# Altium project Enigma Rev B.PrjPCB (part 8 of 8)

## Sheet Power Main Regulators.SchDoc: Main Regulator
size Tabloid; ApprovedBy: NA; CompanyName: Cospan Design LLC; DrawnBy: Dave McCoy; Engineer: Dave McCoy; DocumentNumber: 20; Revision: A; SheetNumber: 20; SheetTotal: 20; Client: Public; Project: Enigma; ProjectPrettyName: Enigma
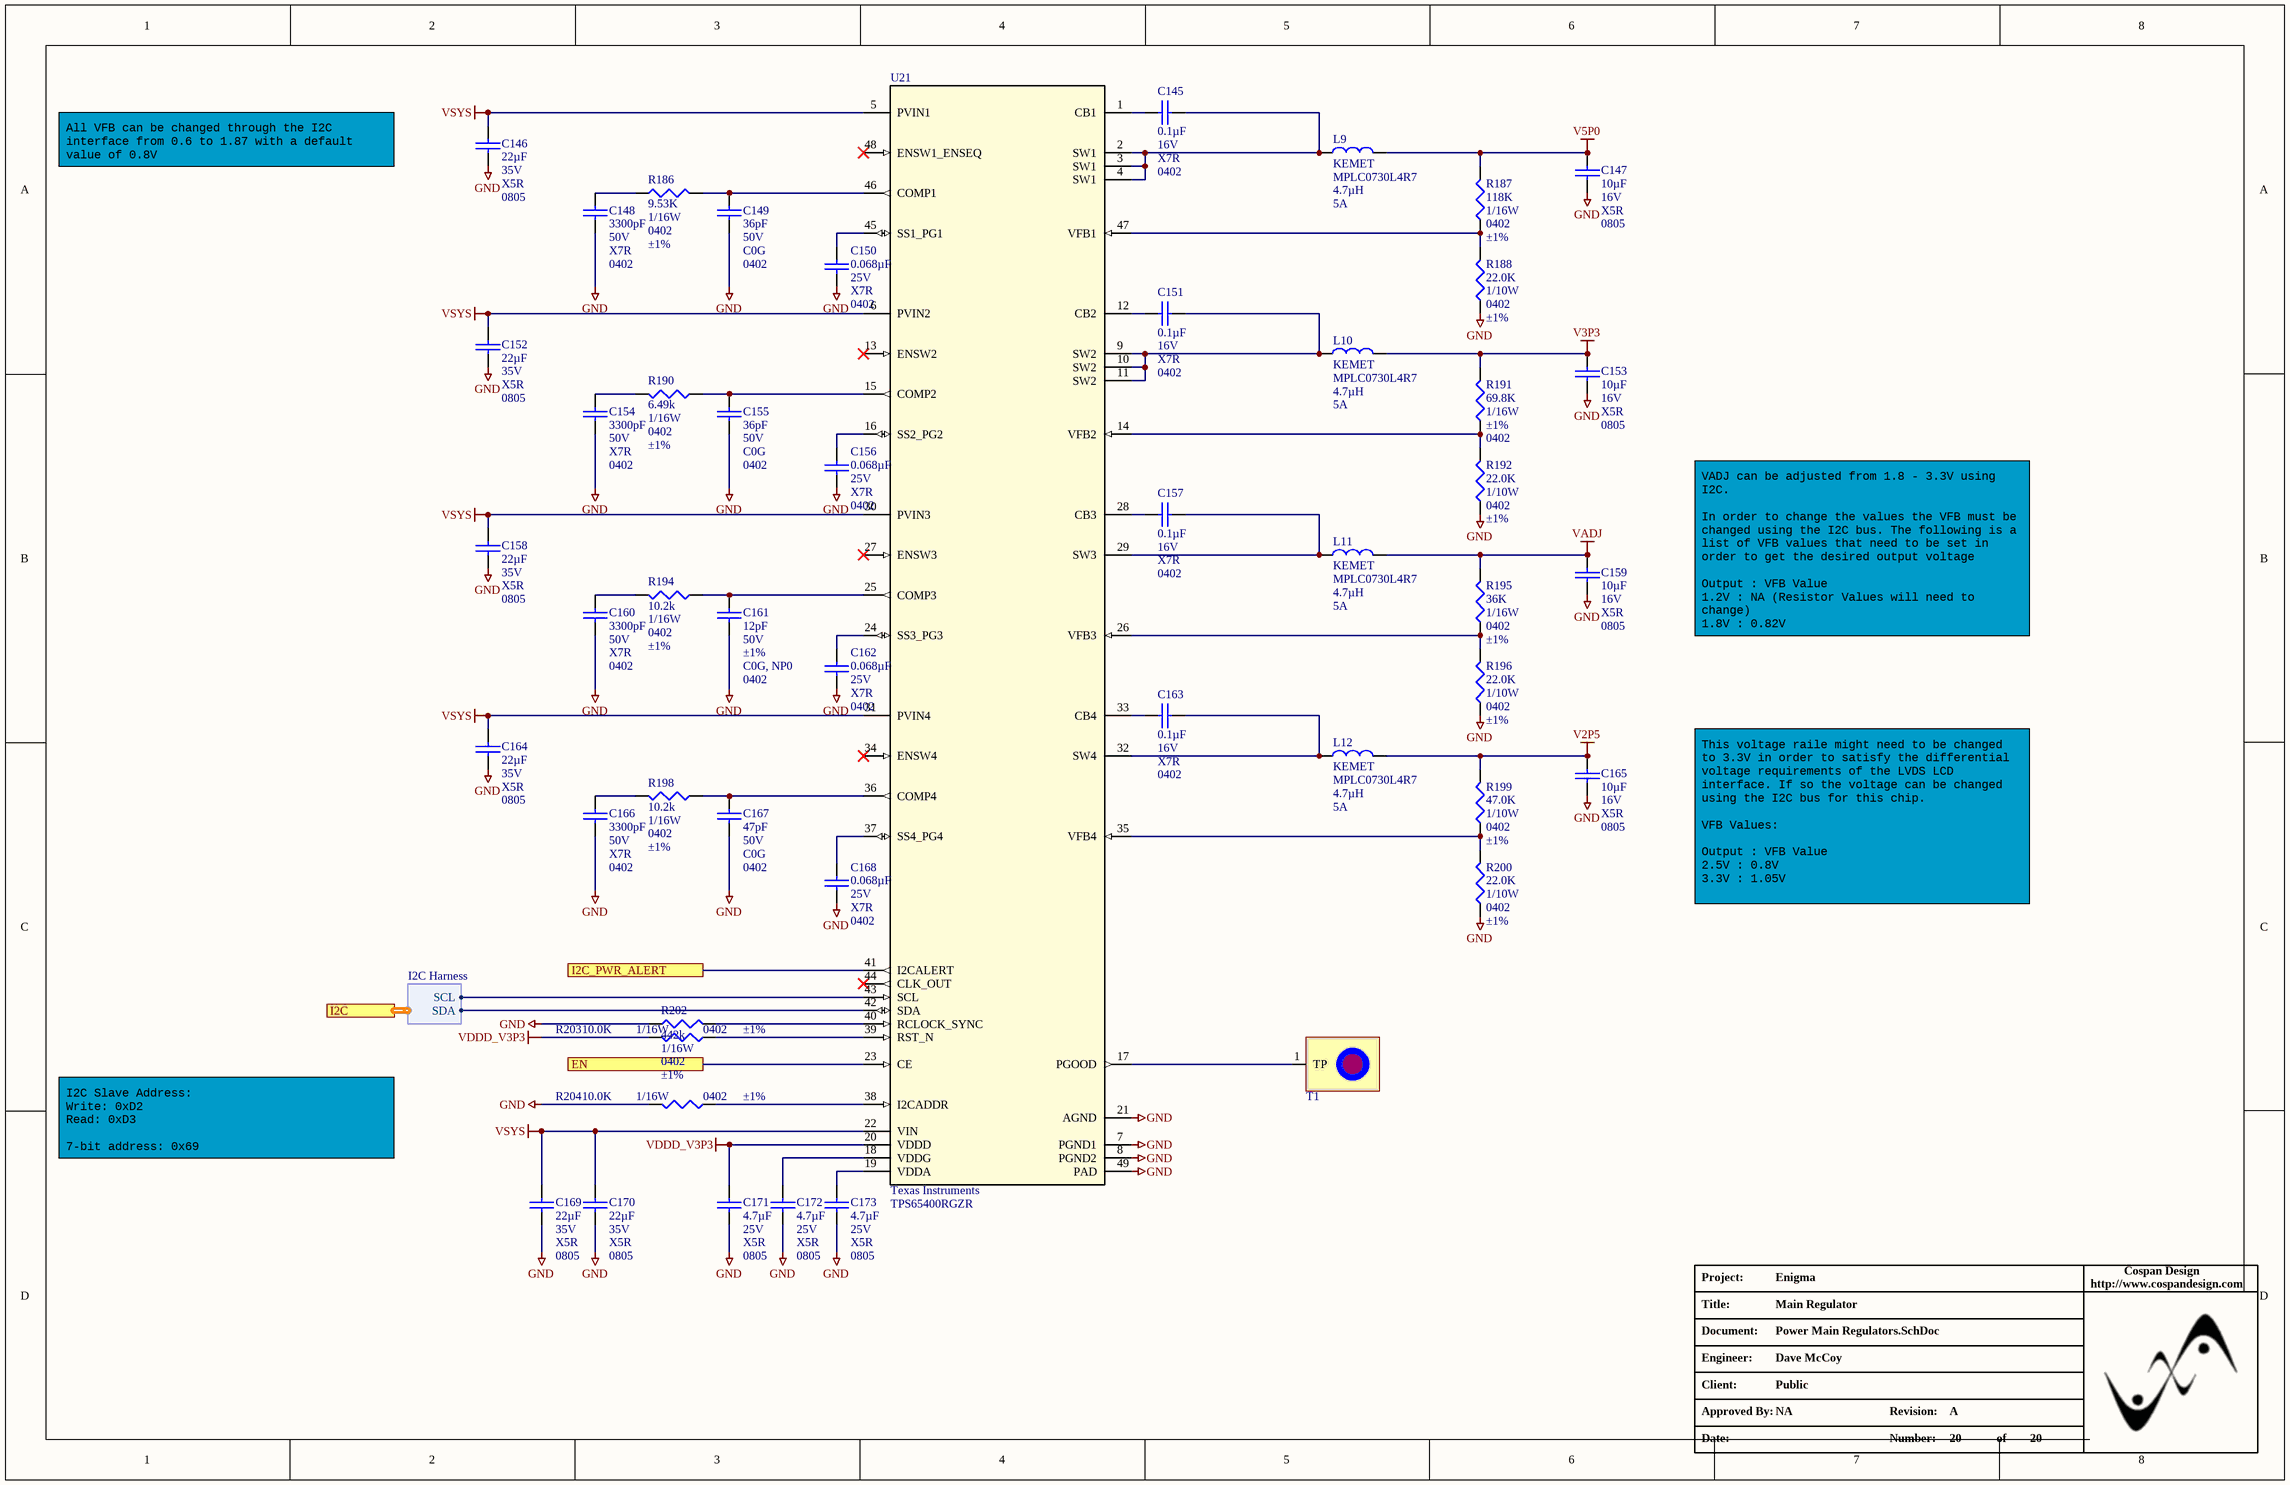
[diagram p13: Power Main Regulators.SchDoc]

### Parts
C145  Capacitance: 0.1µF  Voltage - Rated: 16V  Temperature Coefficient: X7R  Package / Case: 0402  [C_0402]  (hidden comment: 0.1uF)
C146  Capacitance: 22µF  Voltage - Rated: 35V  Temperature Coefficient: X5R  Package / Case: 0805  [C_ERA-0805]  (hidden comment: C_0805_22µF_35V)
C147  Voltage - Rated: 16V  Temperature Coefficient: X5R  Package / Case: 0805  [C_ERA-0805]  (hidden comment: 10µF)
C148  Capacitance: 3300pF  Voltage - Rated: 50V  Temperature Coefficient: X7R  Package / Case: 0402  [C_ERA-0402]  (hidden comment: C_0402_3.3nF_50V)
C149  Capacitance: 36pF  Voltage - Rated: 50V  Temperature Coefficient: C0G  Package / Case: 0402  [C_0402]  (hidden comment: C_0402_36pF)
C150  Capacitance: 0.068µF  Voltage - Rated: 25V  Temperature Coefficient: X7R  Package / Case: 0402  [C_0402]  (hidden comment: C_0402_68nF)
C151  Capacitance: 0.1µF  Voltage - Rated: 16V  Temperature Coefficient: X7R  Package / Case: 0402  [C_0402]  (hidden comment: 0.1uF)
C152  Capacitance: 22µF  Voltage - Rated: 35V  Temperature Coefficient: X5R  Package / Case: 0805  [C_ERA-0805]  (hidden comment: C_0805_22µF_35V)
C153  Voltage - Rated: 16V  Temperature Coefficient: X5R  Package / Case: 0805  [C_ERA-0805]  (hidden comment: 10µF)
C154  Capacitance: 3300pF  Voltage - Rated: 50V  Temperature Coefficient: X7R  Package / Case: 0402  [C_ERA-0402]  (hidden comment: C_0402_3.3nF_50V)
C155  Capacitance: 36pF  Voltage - Rated: 50V  Temperature Coefficient: C0G  Package / Case: 0402  [C_0402]  (hidden comment: C_0402_36pF)
C156  Capacitance: 0.068µF  Voltage - Rated: 25V  Temperature Coefficient: X7R  Package / Case: 0402  [C_0402]  (hidden comment: C_0402_68nF)
C157  Capacitance: 0.1µF  Voltage - Rated: 16V  Temperature Coefficient: X7R  Package / Case: 0402  [C_0402]  (hidden comment: 0.1uF)
C158  Capacitance: 22µF  Voltage - Rated: 35V  Temperature Coefficient: X5R  Package / Case: 0805  [C_ERA-0805]  (hidden comment: C_0805_22µF_35V)
C159  Voltage - Rated: 16V  Temperature Coefficient: X5R  Package / Case: 0805  [C_ERA-0805]  (hidden comment: 10µF)
C160  Capacitance: 3300pF  Voltage - Rated: 50V  Temperature Coefficient: X7R  Package / Case: 0402  [C_ERA-0402]  (hidden comment: C_0402_3.3nF_50V)
C161  Voltage - Rated: 50V  Tolerance: ±1%  Temperature Coefficient: C0G, NP0  Package / Case: 0402  [C_ERA-0402]  (hidden comment: 12pF)
C162  Capacitance: 0.068µF  Voltage - Rated: 25V  Temperature Coefficient: X7R  Package / Case: 0402  [C_0402]  (hidden comment: C_0402_68nF)
C163  Capacitance: 0.1µF  Voltage - Rated: 16V  Temperature Coefficient: X7R  Package / Case: 0402  [C_0402]  (hidden comment: 0.1uF)
C164  Capacitance: 22µF  Voltage - Rated: 35V  Temperature Coefficient: X5R  Package / Case: 0805  [C_ERA-0805]  (hidden comment: C_0805_22µF_35V)
C165  Voltage - Rated: 16V  Temperature Coefficient: X5R  Package / Case: 0805  [C_ERA-0805]  (hidden comment: 10µF)
C166  Capacitance: 3300pF  Voltage - Rated: 50V  Temperature Coefficient: X7R  Package / Case: 0402  [C_ERA-0402]  (hidden comment: C_0402_3.3nF_50V)
C167  Voltage - Rated: 50V  Temperature Coefficient: C0G  Package / Case: 0402  [C_0402]  (hidden comment: 47pF)
C168  Capacitance: 0.068µF  Voltage - Rated: 25V  Temperature Coefficient: X7R  Package / Case: 0402  [C_0402]  (hidden comment: C_0402_68nF)
C169  Capacitance: 22µF  Voltage - Rated: 35V  Temperature Coefficient: X5R  Package / Case: 0805  [C_ERA-0805]  (hidden comment: C_0805_22µF_35V)
C170  Capacitance: 22µF  Voltage - Rated: 35V  Temperature Coefficient: X5R  Package / Case: 0805  [C_ERA-0805]  (hidden comment: C_0805_22µF_35V)
C171  Voltage - Rated: 25V  Temperature Coefficient: X5R  Package / Case: 0805  [C_ERA-0805]  (hidden comment: 4.7µF)
C172  Voltage - Rated: 25V  Temperature Coefficient: X5R  Package / Case: 0805  [C_ERA-0805]  (hidden comment: 4.7µF)
C173  Voltage - Rated: 25V  Temperature Coefficient: X5R  Package / Case: 0805  [C_ERA-0805]  (hidden comment: 4.7µF)
L9  Manufacturer: KEMET  Manufacturer Part Number: MPLC0730L4R7  Inductance: 4.7µH  Max DC Current: 5A  [KEM_L9004_MPLC]  (hidden comment: L_MPLC0730L4R7)
L10  Manufacturer: KEMET  Manufacturer Part Number: MPLC0730L4R7  Inductance: 4.7µH  Max DC Current: 5A  [KEM_L9004_MPLC]  (hidden comment: L_MPLC0730L4R7)
L11  Manufacturer: KEMET  Manufacturer Part Number: MPLC0730L4R7  Inductance: 4.7µH  Max DC Current: 5A  [KEM_L9004_MPLC]  (hidden comment: L_MPLC0730L4R7)
L12  Manufacturer: KEMET  Manufacturer Part Number: MPLC0730L4R7  Inductance: 4.7µH  Max DC Current: 5A  [KEM_L9004_MPLC]  (hidden comment: L_MPLC0730L4R7)
R186  Resistance In Ohms: 9.53K  Power (Watts): 1/16W  Case: 0402  Tolerance: ±1%  [R_0402]  (hidden comment: R_0402_9.53K)
R187  Resistance In Ohms: 118K  Power (Watts): 1/16W  Case: 0402  Tolerance: ±1%  [R_0402]  (hidden comment: R_0402_118K)
R188  Resistance In Ohms: 22.0K  Power (Watts): 1/10W  Case: 0402  Tolerance: ±1%  [R_0402]  (hidden comment: R_0402_22.0K)
R190  Resistance In Ohms: 6.49k  Power (Watts): 1/16W  Case: 0402  Tolerance: ±1%  [R_0402]  (hidden comment: R_0402_6.49k)
R191  Resistance In Ohms: 69.8K  Power (Watts): 1/16W  Tolerance: ±1%  Case: 0402  [R_0402]  (hidden comment: R_0402_69.8K)
R192  Resistance In Ohms: 22.0K  Power (Watts): 1/10W  Case: 0402  Tolerance: ±1%  [R_0402]  (hidden comment: R_0402_22.0K)
R194  Resistance In Ohms: 10.2k  Power (Watts): 1/16W  Case: 0402  Tolerance: ±1%  [R_0402]  (hidden comment: R_0402_10.2k)
R195  Resistance In Ohms: 36K  Power (Watts): 1/16W  Case: 0402  Tolerance: ±1%  [R_0402]  (hidden comment: R_0402_36.0K)
R196  Resistance In Ohms: 22.0K  Power (Watts): 1/10W  Case: 0402  Tolerance: ±1%  [R_0402]  (hidden comment: R_0402_22.0K)
R198  Resistance In Ohms: 10.2k  Power (Watts): 1/16W  Case: 0402  Tolerance: ±1%  [R_0402]  (hidden comment: R_0402_10.2k)
R199  Resistance In Ohms: 47.0K  Power (Watts): 1/10W  Case: 0402  Tolerance: ±1%  [R_0402]  (hidden comment: R_0402_47.0K)
R200  Resistance In Ohms: 22.0K  Power (Watts): 1/10W  Case: 0402  Tolerance: ±1%  [R_0402]  (hidden comment: R_0402_22.0K)
R202  Resistance In Ohms: 442k  Power (Watts): 1/16W  Case: 0402  Tolerance: ±1%  [R_0402]  (hidden comment: R_0402_442k)
R203  Resistance In Ohms: 10.0K  Power (Watts): 1/16W  Case: 0402  Tolerance: ±1%  [R_0402]  (hidden comment: R_0402_10.0K)
R204  Resistance In Ohms: 10.0K  Power (Watts): 1/16W  Case: 0402  Tolerance: ±1%  [R_0402]  (hidden comment: R_0402_10.0K)
T1  TEST_POINT_SMALL  [TestPointSmall]  (value not drawn)  (no BOM)
U21  Manufacturer: Texas Instruments  Manufacturer Part Number: TPS65400RGZR  [RGZ0048B]  (hidden comment: U_TPS65400RGZR)

### Ports
EN, I2C (harness I2C Harness), I2C_PWR_ALERT

### Harnesses
I2C Harness: SCL, SDA

### Nets
GND: C146.1 C147.1 C148.1 C149.1 C150.1 C152.1 C153.1 C154.1 C155.1 C156.1 C158.1 C159.1 C160.1 C161.1 C162.1 C164.1 C165.1 C166.1 C167.1 C168.1 C169.1 C170.1 C171.1 C172.1 C173.1 R188.2 R192.2 R196.2 R200.2 R202.2 R204.1 U21.7(PGND1) U21.8(PGND2) U21.21(AGND) U21.49(PAD)
V2P5: C165.2 L12.1 R199.1
V3P3: C153.2 L10.1 R191.1
V5P0: C147.2 L9.1 R187.1
VADJ: C159.2 L11.1 R195.1
VDDD_V3P3: C171.2 R203.1 U21.20(VDDD)
VSYS: C146.2 C152.2 C158.2 C164.2 C169.2 C170.2 U21.5(PVIN1) U21.6(PVIN2) U21.22(VIN) U21.30(PVIN3) U21.31(PVIN4)
INT_REG_EN: U21.23(CE) ; port EN
TOUCH_SCL: U21.43(SCL) ; port I2C.SCL
TOUCH_SDA: U21.42(SDA) ; port I2C.SDA
NetC145_1: C145.1 L9.2 U21.2(SW1) U21.3(SW1) U21.4(SW1)
NetC145_2: C145.2 U21.1(CB1)
NetC148_2: C148.2 R186.2
NetC149_2: C149.2 R186.1 U21.46(COMP1)
NetC150_2: C150.2 U21.45(SS1_PG1)
NetC151_1: C151.1 L10.2 U21.9(SW2) U21.10(SW2) U21.11(SW2)
NetC151_2: C151.2 U21.12(CB2)
NetC154_2: C154.2 R190.1
NetC155_2: C155.2 R190.2 U21.15(COMP2)
NetC156_2: C156.2 U21.16(SS2_PG2)
NetC157_1: C157.1 L11.2 U21.29(SW3)
NetC157_2: C157.2 U21.28(CB3)
NetC160_2: C160.2 R194.1
NetC161_2: C161.2 R194.2 U21.25(COMP3)
NetC162_2: C162.2 U21.24(SS3_PG3)
NetC163_1: C163.1 L12.2 U21.32(SW4)
NetC163_2: C163.2 U21.33(CB4)
NetC166_2: C166.2 R198.1
NetC167_2: C167.2 R198.2 U21.36(COMP4)
NetC168_2: C168.2 U21.37(SS4_PG4)
NetC172_2: C172.2 U21.18(VDDG)
NetC173_2: C173.2 U21.19(VDDA)
NetR187_2: R187.2 R188.1 U21.47(VFB1)
NetR191_2: R191.2 R192.1 U21.14(VFB2)
NetR195_2: R195.2 R196.1 U21.26(VFB3)
NetR199_2: R199.2 R200.1 U21.35(VFB4)
NetR202_1: R202.1 U21.40(RCLOCK_SYNC)
NetR203_2: R203.2 U21.39(RST_N)
NetR204_2: R204.2 U21.38(I2CADDR)
NetT1_1: T1.1(TP) U21.17(PGOOD)
NetT2_1: U21.41(I2CALERT) ; port I2C_PWR_ALERT

Not connected (* = marked no-connect by the designer): U21 13(ENSW2)* 27(ENSW3)* 34(ENSW4)* 44(CLK_OUT)* 48(ENSW1_ENSEQ)*

### Notes on the sheet
- All VFB can be changed through the I2C interface from 0.6 to 1.87 with a default value of 0.8V
- VADJ can be adjusted from 1.8 - 3.3V using I2C.
  In order to change the values the VFB must be changed using the I2C bus. The following is a list of VFB values that need to be set in order to get the desired output voltage
  Output	: VFB Value
  1.2V	: NA (Resistor Values will need to change)
  1.8V	: 0.82V
  2.5V	: 1.14V
  3.3V	: 1.51V
- This voltage raile might need to be changed to 3.3V in order to satisfy the differential voltage requirements of the LVDS LCD interface. If so the voltage can be changed using the I2C bus for this chip.
  VFB Values:
  Output	: VFB Value
  2.5V	: 0.8V
  3.3V	: 1.05V
- I2C Slave Address:
  Write: 0xD2
  Read: 0xD3
  7-bit address: 0x69
- Project:
- http://www.cospandesign.com
- Cospan Design
- Document:
- Engineer:
- Title:
- Client:
- Approved By:
- Revision:
- Date:
- Number:
- of

### Library data of the parts
C145 C151 C157 C163 = C_0402_0.1UF_16V: CAP CER .10UF 16V X7R 0402; Manufacturer: Murata Electronics North America; Manufacturer Part Number: GRM155R71C104KA88J; Tolerance: ±10%; Supplier 1: Digi-Key; RoHS: RoHS Compliant; Category: Capacitors; Stock 1: 18103134; Pricing 1: 1=0.1, 10=0.014, 100=0.0062, 500=0.00442, 1000=0.00348, 2500=0.00316, 5000=0.00291 (USD); Packaging: Cut Tape (CT); Part Status: Active; Operating Temperature: -55°C ~ 125°C; Features: -; Ratings: -; Applications: General Purpose; Mounting Type: Surface Mount, MLCC; Size / Dimension: 0.039" L x 0.020" W (1.00mm x 0.50mm); Height - Seated (Max): -; Thickness (Max): 0.022" (0.55mm); Lead Spacing: -; ComponentLink1URL: http://www.murata.com/~/media/webrenewal/support/library/catalog/products/capacitor/mlcc/c02e.ashx?la=en-us; ComponentLink1Description: http://www.murata.com/~/media/webrenewal/support/library/catalog/products/capacitor/mlcc/c02e.ashx?la=en-us; Supplier Part Number 1: 490-6328-1-ND
C146 C152 C158 C164 C169 C170 = C_0805_22µF_35V: CAP CER 22UF 35V X5R 0805; Manufacturer: TDK Corporation; Manufacturer Part Number: C2012X5R1V226M125AC; Tolerance: ±20%; Supplier 1: Digi-Key; RoHS: RoHS Compliant; Category: Capacitors; Stock 1: 3681; Pricing 1: 1=1.14, 10=0.863, 100=0.6176, 500=0.47818, 1000=0.41176 (USD); Packaging: Cut Tape (CT); Mounting Type: Surface Mount, MLCC; Operating Temperature: -55°C ~ 85°C; Applications: General Purpose; Ratings: -; Size / Dimension: 0.079" L x 0.049" W (2.00mm x 1.25mm); Height - Seated (Max): -; Thickness (Max): 0.057" (1.45mm); Lead Spacing: -; Features: Low ESL; Lead Style: -; ComponentLink1URL: https://product.tdk.com/info/en/catalog/datasheets/mlcc_commercial_general_en.pdf; ComponentLink1Description: https://product.tdk.com/info/en/catalog/datasheets/mlcc_commercial_general_en.pdf; Supplier Part Number 1: 445-14428-1-ND; Part Status: Active; Failure Rate: -
C147 C153 C159 C165 = C_0805_10UF_16V: CAP CER 10uF 16V X5R 20% 0805; Manufacturer: Taiyo Yuden; Manufacturer Part Number: EMK212BJ106KG-T; Tolerance: ±10%; Supplier 1: Digi-Key; Supplier Part Number 1: 587-1295-1-ND; Category: Capacitors; Stock 1: 2052124; Capacitance: 10µF; RoHS: RoHS Compliant; Pricing 1: 1=0.2, 10=0.139, 100=0.0656, 500=0.04596, 1000=0.03805 (USD); Packaging: Cut Tape (CT); Part Status: Active; Operating Temperature: -55°C ~ 85°C; Features: -; Ratings: -; Applications: General Purpose; Mounting Type: Surface Mount, MLCC; Size / Dimension: 0.079" L x 0.049" W (2.00mm x 1.25mm); Height - Seated (Max): -; Thickness (Max): 0.053" (1.35mm); Lead Spacing: -; Lead Style: -; ComponentLink1URL: http://www.yuden.co.jp/productdata/catalog/en/mlcc01_e.pdf; ComponentLink1Description: http://www.yuden.co.jp/productdata/catalog/en/mlcc01_e.pdf
C148 C154 C160 C166 = C_0402_3.3nF_50V: Manufacturer: Murata Electronics North America; Manufacturer Part Number: GRM155R71H332KA01D; Tolerance: ±10%; Supplier 1: Digi-Key; Supplier Part Number 1: 490-3248-1-ND; RoHS: RoHS Compliant; Category: Capacitors; Stock 1: 717319; Mounting Type: Surface Mount, MLCC; Operating Temperature: -55°C ~ 125°C; Applications: General Purpose; Size / Dimension: 0.039" L x 0.020" W (1.00mm x 0.50mm); Thickness (Max): 0.022" (0.55mm); Packaging: Cut Tape (CT); ComponentLink1URL: http://www.murata.com/~/media/webrenewal/support/library/catalog/products/capacitor/mlcc/c02e.ashx?la=en-us; ComponentLink1Description: http://www.murata.com/~/media/webrenewal/support/library/catalog/products/capacitor/mlcc/c02e.ashx?la=en-us; Pricing 1: 1=0.1, 10=0.013, 100=0.0059, 500=0.0042, 1000=0.0033, 2500=0.003, 5000=0.00276 (USD); Part Status: Active; Features: -; Ratings: -; Height - Seated (Max): -; Lead Spacing: -; Lead Style: -
C149 C155 = C_0402_36pF: CAP CER 36PF 50V NP0 0402; Manufacturer: Samsung Electro-Mechanics America, Inc.; Manufacturer Part Number: CL05C360JB5NNNC; Tolerance: ±5%; Supplier 1: Digi-Key; RoHS: RoHS Compliant; Category: Capacitors; Stock 1: 24626; Pricing 1: 1=0.1, 10=0.03, 25=0.0208, 50=0.016, 100=0.0135, 500=0.00948, 1000=0.00738, 5000=0.00615 (USD); Packaging: Cut Tape (CT); Mounting Type: Surface Mount, MLCC; Operating Temperature: -55°C ~ 125°C; Applications: General Purpose; Ratings: -; Size / Dimension: 0.039" L x 0.020" W (1.00mm x 0.50mm); Height - Seated (Max): -; Thickness (Max): 0.022" (0.55mm); Lead Spacing: -; Features: -; Lead Style: -; ComponentLink1URL: http://www.samsungsem.com/kr/support/product-search/mlcc/CL05C360JB5NNNC.jsp; ComponentLink1Description: http://www.samsungsem.com/kr/support/product-search/mlcc/CL05C360JB5NNNC.jsp; Supplier Part Number 1: 1276-1686-1-ND
C150 C156 C162 C168 = C_0402_68nF: CAP CER 0.068UF 25V X7R 0402; Manufacturer: Murata Electronics North America; Manufacturer Part Number: GRM155R71E683KE14D; Tolerance: ±10%; Supplier 1: Digi-Key; RoHS: RoHS Compliant; Category: Capacitors; Stock 1: 7620; Pricing 1: 1=0.1, 10=0.031, 100=0.0136, 500=0.00974, 1000=0.00765, 2500=0.00696, 5000=0.0064 (USD); Packaging: Cut Tape (CT); Part Status: Active; Operating Temperature: -55°C ~ 125°C; Features: -; Ratings: -; Applications: General Purpose; Failure Rate: -; Mounting Type: Surface Mount, MLCC; Size / Dimension: 0.039" L x 0.020" W (1.00mm x 0.50mm); Height - Seated (Max): -; Thickness (Max): 0.022" (0.55mm); Lead Spacing: -; Lead Style: -; ComponentLink1URL: http://search.murata.co.jp/Ceramy/image/img/A01X/G101/ENG/GRM155R71E683KE14-01.pdf; ComponentLink1Description: http://search.murata.co.jp/Ceramy/image/img/A01X/G101/ENG/GRM155R71E683KE14-01.pdf; Supplier Part Number 1: 490-14604-1-ND
C161 = C_0402_12PF_50V: CAP CER 12PF 50V 5% C0G 0402; Manufacturer: Murata Electronics North America; Manufacturer Part Number: GRM1555C1H120FA01D; Supplier 1: Digi-Key; Supplier Part Number 1: 490-6196-1-ND; RoHS: RoHS Compliant; Category: Capacitors; Stock 1: 386052; Mounting Type: Surface Mount, MLCC; Operating Temperature: -55°C ~ 125°C; Applications: General Purpose; Ratings: -; Size / Dimension: 0.039" L x 0.020" W (1.00mm x 0.50mm); Lead Spacing: -; Features: -; Packaging: Cut Tape (CT); Lead Style: -; ComponentLink1URL: http://search.murata.co.jp/Ceramy/image/img/A01X/G101/ENG/GRM1555C1H120FA01-01.pdf; ComponentLink1Description: http://search.murata.co.jp/Ceramy/image/img/A01X/G101/ENG/GRM1555C1H120FA01-01.pdf; Capacitance: 12pF; Pricing 1: 1=0.1, 10=0.05, 100=0.0223, 500=0.01594, 1000=0.01252, 2500=0.01138, 5000=0.01047 (USD); Part Status: Active; Height - Seated (Max): -; Thickness (Max): 0.022" (0.55mm)
C167 = C_0402_47p_50V: CAP CER 47PF 50V 5% C0G 0402; Manufacturer: Murata Electronics North America; Manufacturer Part Number: GRM1555C1H470JA01D; Supplier 1: Digi-Key; RoHS: RoHS Compliant; Category: Capacitors; Stock 1: 682755; Pricing 1: 1=0.1, 10=0.013, 50=0.007, 100=0.0059, 250=0.00488, 500=0.00416, 1000=0.00324, 5000=0.0027 (USD); Packaging: Cut Tape (CT); Tolerance: ±5%; Mounting Type: Surface Mount, MLCC; Operating Temperature: -55°C ~ 125°C; Applications: General Purpose; Ratings: -; Size / Dimension: 0.039" L x 0.020" W (1.00mm x 0.50mm); Height - Seated (Max): -; Thickness (Max): 0.022" (0.55mm); Lead Spacing: -; Features: -; Lead Style: -; ComponentLink1URL: http://www.murata.com/~/media/webrenewal/support/library/catalog/products/capacitor/mlcc/c02e.ashx; ComponentLink1Description: http://www.murata.com/~/media/webrenewal/support/library/catalog/products/capacitor/mlcc/c02e.ashx; Supplier Part Number 1: 490-5942-1-ND; Capacitance: 47pF
C171-C173 = C_0805_4.7µF_25V: CAP CER 4.7UF 25V 10% X5R 0805; Manufacturer: Taiyo Yuden; Manufacturer Part Number: TMK212BJ475KG-T; Supplier 1: Digi-Key; RoHS: RoHS Compliant; Category: Capacitors; Stock 1: 38955; Pricing 1: 1=0.24, 10=0.2, 50=0.1126, 100=0.1, 250=0.075, 500=0.06626, 1000=0.05875 (USD); Tolerance: ±10%; Mounting Type: Surface Mount, MLCC; Operating Temperature: -55°C ~ 85°C; Applications: General Purpose; Ratings: -; Size / Dimension: 0.079" L x 0.049" W (2.00mm x 1.25mm); Height - Seated (Max): -; Thickness (Max): 0.053" (1.35mm); Lead Spacing: -; Features: -; Packaging: Cut Tape (CT); Lead Style: -; ComponentLink1URL: http://www.yuden.co.jp/productdata/catalog/en/mlcc01_e.pdf; ComponentLink1Description: http://www.yuden.co.jp/productdata/catalog/en/mlcc01_e.pdf; Supplier Part Number 1: 587-1782-1-ND; Capacitance: 4.7µF
L9-L12 = L_MPLC0730L4R7: FIXED IND 4.7UH 5A 41 MOHM SMD; Type: Wirewound; Tolerance: ±20%; Shielding: Shielded; DC Resistance (DCR): 41 mOhm Max; Supplier 1: Digi-Key; RoHS: RoHS Compliant; Category: Inductors, Coils, Chokes; Stock 1: 3443; Pricing 1: 1=0.9, 10=0.837, 25=0.7728, 50=0.644, 100=0.6054, 250=0.54096, 500=0.46368 (USD); Packaging: Cut Tape (CT); Part Status: Active; Material - Core: -; Q @ Freq: -; Ratings: -; Operating Temperature: -20°C ~ 120°C; Mounting Type: Surface Mount; Package / Case: 2-SMD, J-Lead; Supplier Device Package: -; Size / Dimension: 0.303" L x 0.264" W (7.70mm x 6.70mm); Height - Seated (Max): 0.118" (3.00mm); ComponentLink1URL: https://search.kemet.com/component-edge/download/datasheet/MPLC0730L4R7.pdf; ComponentLink1Description: https://search.kemet.com/component-edge/download/datasheet/MPLC0730L4R7.pdf; Supplier Part Number 1: 399-10992-1-ND
R186 = R_0402_9.53K: RES SMD 9.53K OHM 1% 1/16W 0402; Manufacturer: Yageo; Manufacturer Part Number: RC0402FR-079K53L; Temperature Coefficient: ±100ppm/°C; Supplier 1: Digi-Key; RoHS: RoHS Compliant; Category: Resistors; Stock 1: 234095; Pricing 1: 1=0.1, 10=0.013, 25=0.0096, 100=0.0054, 250=0.00412, 500=0.00328, 1000=0.00242, 2500=0.0021, 5000=0.00173 (USD); Packaging: Cut Tape (CT); Part Status: Active; Resistance (Ohms): 9.53k; Composition: Thick Film; Features: Moisture Resistant; Operating Temperature: -55°C ~ 155°C; Package / Case: 0402 (1005 Metric); Supplier Device Package: 0402; Size / Dimension: 0.039" L x 0.020" W (1.00mm x 0.50mm); Height: 0.016" (0.40mm); Number of Terminations: 2; ComponentLink1URL: http://www.yageo.com/documents/recent/PYu-RC_Group_51_RoHS_L_04.pdf; ComponentLink1Description: http://www.yageo.com/documents/recent/PYu-RC_Group_51_RoHS_L_04.pdf; Supplier Part Number 1: 311-9.53KLRCT-ND
R187 = R_0402_118K: RES SMD 118K OHM 1% 1/16W 0402; Manufacturer: Stackpole Electronics Inc; Manufacturer Part Number: RMCF0402FT118K; Temperature Coefficient: ±100ppm/°C; Supplier 1: Digi-Key; RoHS: RoHS Compliant; Category: Resistors; Stock 1: 43108; Pricing 1: 1=0.1, 10=0.025, 50=0.0138, 100=0.0105, 250=0.0078, 500=0.00576, 1000=0.00384, 2500=0.00324, 5000=0.0027 (USD); Packaging: Cut Tape (CT); Resistance (Ohms): 118k; Composition: Thick Film; Features: Automotive AEC-Q200; Operating Temperature: -55°C ~ 155°C; Package / Case: 0402 (1005 Metric); Supplier Device Package: 0402; Size / Dimension: 0.039" L x 0.020" W (1.00mm x 0.50mm); Height: 0.016" (0.40mm); Number of Terminations: 2; ComponentLink1URL: http://www.seielect.com/Catalog/SEI-RMCF_RMCP.pdf; ComponentLink1Description: http://www.seielect.com/Catalog/SEI-RMCF_RMCP.pdf; Supplier Part Number 1: RMCF0402FT118KCT-ND
R188 R192 R196 R200 = R_0402_22.0K: RES 22.0K OHM 1/10W 1% 0402 SMD; Manufacturer: Vishay Dale; Manufacturer Part Number: CRCW040222K0FKED; Resistance (Ohms): 22k; Temperature Coefficient: ±100ppm/°C; Supplier 1: Digi-Key; Supplier Part Number 1: 541-22.0KLCT-ND; RoHS: RoHS Compliant; Category: Resistors; Stock 1: 15892; Pricing: 10=0.083, 50=0.0444, 200=0.0255, 1000=0.0174 (USD); Composition: Thick Film; Features: -; Package / Case: 0402 (1005 Metric); Size / Dimension: 0.039" L x 0.020" W (1.00mm x 0.50mm); Height: 0.016" (0.40mm); Number of Terminations: 2; Packaging: Cut Tape (CT); ComponentLink1URL: http://www.vishay.com/doc?20035; ComponentLink1Description: http://www.vishay.com/doc?20035
R190 = R_0402_6.49k: RES SMD 6.49K OHM 1% 1/16W 0402; Manufacturer: Samsung Electro-Mechanics America, Inc.; Manufacturer Part Number: RC1005F6491CS; Temperature Coefficient: ±100ppm/°C; Supplier 1: Digi-Key; RoHS: RoHS Compliant; Category: Resistors; Stock 1: 45311; Pricing 1: 1=0.1, 10=0.013, 25=0.0096, 50=0.0074, 100=0.0054, 250=0.00412, 500=0.00328, 1000=0.00242, 2500=0.0021 (USD); Packaging: Cut Tape (CT); Resistance (Ohms): 6.49k; Composition: Thick Film; Features: -; Operating Temperature: -55°C ~ 155°C; Package / Case: 0402 (1005 Metric); Supplier Device Package: 0402 (1005 Metric); Size / Dimension: 0.039" L x 0.020" W (1.00mm x 0.50mm); Height: 0.016" (0.40mm); Number of Terminations: 2; ComponentLink1URL: http://media.digikey.com/pdf/Data%20Sheets/Samsung%20PDFs/RC_Series_ds.pdf; ComponentLink1Description: http://media.digikey.com/pdf/Data%20Sheets/Samsung%20PDFs/RC_Series_ds.pdf; Supplier Part Number 1: 1276-4096-1-ND
R191 = R_0402_69.8K: RES 69.8K OHM 1/16W 1% 0402 SMD; Manufacturer: Yageo; Manufacturer Part Number: RC0402FR-0769K8L; Temperature Coefficient: ±100ppm/°C; Supplier 1: Digi-Key; Supplier Part Number 1: YAG3216CT-ND; RoHS: RoHS Compliant; Category: Resistors; Stock 1: 160383; Composition: Thick Film; Features: Moisture Resistant; Package / Case: 0402 (1005 Metric); Size / Dimension: 0.039" L x 0.020" W (1.00mm x 0.50mm); Packaging: Cut Tape (CT); ComponentLink1URL: http://www.yageo.com/documents/recent/PYu-RC_Group_51_RoHS_L_7.pdf; ComponentLink1Description: http://www.yageo.com/documents/recent/PYu-RC_Group_51_RoHS_L_7.pdf; Pricing 1: 1=0.1, 10=0.014, 100=0.0055, 1000=0.00247, 2500=0.00214, 5000=0.00177 (USD); Part Status: Active; Operating Temperature: -55°C ~ 155°C; Supplier Device Package: 0402; Height - Seated (Max): 0.016" (0.40mm); Failure Rate: -
R194 R198 = R_0402_10.2k: RES SMD 10.2K OHM 1% 1/16W 0402; Manufacturer: Stackpole Electronics Inc.; Manufacturer Part Number: RMCF0402FT10K2; Temperature Coefficient: ±100ppm/°C; Supplier 1: Digi-Key; RoHS: RoHS Compliant; Category: Resistors; Stock 1: 69477; Pricing 1: 1=0.1, 10=0.019, 50=0.0106, 100=0.0078, 250=0.00596, 500=0.00476, 1000=0.0035, 2500=0.00304, 5000=0.00251 (USD); Packaging: Cut Tape (CT); Resistance (Ohms): 10.2k; Composition: Thick Film; Features: Automotive AEC-Q200; Operating Temperature: -55°C ~ 155°C; Package / Case: 0402 (1005 Metric); Supplier Device Package: 0402; Size / Dimension: 0.039" L x 0.020" W (1.00mm x 0.50mm); Height: 0.016" (0.40mm); Number of Terminations: 2; ComponentLink1URL: http://www.seielect.com/Catalog/SEI-RMCF_RMCP.pdf; ComponentLink1Description: http://www.seielect.com/Catalog/SEI-RMCF_RMCP.pdf; Supplier Part Number 1: RMCF0402FT10K2CT-ND
R195 = R_0402_36.0K: RES 36.0K OHM 1/10W 1% 0402 SMD; Manufacturer: Panasonic - ECG; Manufacturer Part Number: ERJ-2RKF3602X; Temperature Coefficient: ±100ppm/°C; Supplier 1: Digi-Key; Supplier Part Number 1: P36.0KLCT-ND; RoHS: RoHS Compliant; Category: Resistors; Stock 1: 39656; Pricing: 1=0.06, 50=0.0242, 100=0.0184, 250=0.01364, 500=0.01008, 1000=0.00672, 5000=0.00473 (USD); Resistance (Ohms): 36K; Composition: Thick Film; Features: -; Size / Dimension: 0.039" L x 0.020" W (1.00mm x 0.50mm); Height: 0.016" (0.40mm); Number of Terminations: 2; Packaging: Cut Tape (CT); Package / Case: 0402 (1005 Metric); ComponentLink1URL: http://industrial.panasonic.com/www-cgi/jvcr13pz.cgi?E+PZ+3+AOA0002+ERJ2RKF3602X+7+WW; ComponentLink1Description: http://industrial.panasonic.com/www-cgi/jvcr13pz.cgi?E+PZ+3+AOA0002+ERJ2RKF3602X+7+WW
R199 = R_0402_47.0K: RES 47.0K OHM 1/10W 1% 0402 SMD; Manufacturer: Panasonic - ECG; Manufacturer Part Number: ERJ-2RKF4702X; Resistance (Ohms): 47K; Temperature Coefficient: ±100ppm/°C; Supplier 1: Digi-Key; Supplier Part Number 1: P47.0KLCT-ND; RoHS: RoHS Compliant; Category: Resistors; Stock 1: 503654; Pricing: 1=0.06, 50=0.0242, 100=0.0184, 250=0.01364, 500=0.01008, 1000=0.00672, 5000=0.00473 (USD); Composition: Thick Film; Features: -; Size / Dimension: 0.039" L x 0.020" W (1.00mm x 0.50mm); Height: 0.014" (0.35mm); Number of Terminations: 2; Packaging: Cut Tape (CT); Package / Case: 0402 (1005 Metric); ComponentLink1URL: http://industrial.panasonic.com/www-cgi/jvcr13pz.cgi?E+PZ+3+AOA0002+ERJ2RKF4702X+7+WW; ComponentLink1Description: http://industrial.panasonic.com/www-cgi/jvcr13pz.cgi?E+PZ+3+AOA0002+ERJ2RKF4702X+7+WW
R202 = R_0402_442k: RES SMD 442K OHM 1% 1/16W 0402; Manufacturer: Yageo; Manufacturer Part Number: RC0402FR-07442KL; Temperature Coefficient: ±100ppm/°C; Supplier 1: Digi-Key; Stock 1: 113995; Pricing 1: 1=0.1, 10=0.014, 100=0.0056, 1000=0.00253, 2500=0.0022, 5000=0.00181 (USD); Packaging: Cut Tape (CT); Composition: Thick Film; ComponentLink1URL: http://www.yageo.com/documents/recent/PYu-RC_Group_51_RoHS_L_7.pdf; ComponentLink1Description: http://www.yageo.com/documents/recent/PYu-RC_Group_51_RoHS_L_7.pdf; Supplier Part Number 1: 311-442KLRCT-ND; RoHS: RoHS Compliant; Category: Resistors; Part Status: Active; Features: Moisture Resistant; Operating Temperature: -55°C ~ 155°C; Package / Case: 0402 (1005 Metric); Supplier Device Package: 0402; Size / Dimension: 0.039" L x 0.020" W (1.00mm x 0.50mm); Height - Seated (Max): 0.016" (0.40mm); Failure Rate: -
R203 R204 = R_0402_10.0K: RES 10.0K OHM 1/16W 1% 0402 SMD; Manufacturer: Stackpole Electronics Inc; Manufacturer Part Number: RMCF0402FT10K0; Resistance (Ohms): 10k; Temperature Coefficient: ±100ppm/°C; Supplier 1: Digi-Key; Supplier Part Number 1: RMCF0402FT10K0CT-ND; RoHS: RoHS Compliant; Category: Resistors; Stock 1: 234525; Pricing: 1=0.04, 10=0.025, 50=0.0138, 100=0.0105, 250=0.0078, 500=0.00576, 1000=0.00384, 2500=0.00324, 5000=0.0027 (USD); Composition: Thick Film; Features: -; Package / Case: 0402 (1005 Metric); Size / Dimension: 0.039" L x 0.020" W (1.00mm x 0.50mm); Height: 0.016" (0.40mm); Number of Terminations: 2; Packaging: Cut Tape (CT); ComponentLink1URL: http://www.seielect.com/Catalog/SEI-RMCF_RMCP.pdf; ComponentLink1Description: http://www.seielect.com/Catalog/SEI-RMCF_RMCP.pdf
T1 = TEST_POINT_SMALL: OSCILLOSCOPE TEST POINT
U21 = U_TPS65400RGZR: IC REG BUCK ADJ 4A/2A QD 48VQFN; Function: Step-Down; Output Configuration: Positive; Output Type: Adjustable; Number of Outputs: 4; Voltage - Input (Min): 4.5V; Voltage - Input (Max): 18V; Voltage - Output (Min/Fixed): 0.6V; Voltage - Output (Max): 16.2V; Current - Output: 4A, 2A; Frequency - Switching: 275kHz ~ 2.2MHz; Synchronous Rectifier: Yes; Application_BuildNumber: *; Supplier 1: Digi-Key; RoHS: RoHS Compliant; Category: Integrated Circuits (ICs); Stock 1: 2343; Pricing 1: 1=5.16, 10=4.633, 100=3.7961, 500=3.23152, 1000=2.72538 (USD); Packaging: Cut Tape (CT); Part Status: Active; Topology: Buck; Operating Temperature: -40°C ~ 125°C (TJ); Mounting Type: Surface Mount; Package / Case: 48-VFQFN Exposed Pad; Supplier Device Package: 48-VQFN (7x7); ComponentLink1URL: http://www.ti.com/lit/ds/symlink/tps65400.pdf; ComponentLink1Description: http://www.ti.com/lit/ds/symlink/tps65400.pdf; Supplier Part Number 1: 296-40902-1-ND

## Nets that join several sheets
GND: Block Diagram (J29.8), User Interface (22 pins), Snickerdoodle PS (24 pins), Snickerdoodle FPGA JA (22 pins), Snickerdoodle FPGA JB (24 pins), LCD (56 pins), USB Type C (41 pins), I2S Audio (26 pins), USB Phy (13 pins), FMC 400 Pin (164 pins), Power (12 pins), Battery Manager (33 pins), Power Main Regulators (35 pins)
SNK_VIN: Snickerdoodle PS (C186.2 C188.2 J27.29 J27.30), Power (C144.2 U20.8)
V1P8: Block Diagram (R1.1), User Interface (8 pins), Snickerdoodle PS (R68.1), USB Phy (8 pins), Power (C209.2 R185.1 U22.2)
V2P5: Block Diagram (J29.7), LCD (10 pins), Power Main Regulators (C165.2 L12.1 R199.1)
V3P3: Block Diagram (J29.5 R116.1 R117.1), User Interface (5 pins), Snickerdoodle FPGA JA (8 pins), LCD (17 pins), USB Type C (C57.2 D?.3 U4.53), I2S Audio (9 pins), FMC 400 Pin (5 pins), Power (C128.2 U22.3), Battery Manager (D10.3), Power Main Regulators (C153.2 L10.1 R191.1)
V5P0: Block Diagram (J29.4), LCD (6 pins), USB Type C (C50.2 U4.14 U4.27 U4.28), USB Phy (7 pins), Power Main Regulators (C147.2 L9.1 R187.1)
VADJ: Block Diagram (J29.6), Snickerdoodle FPGA JB (5 pins), FMC 400 Pin (8 pins), Power Main Regulators (C159.2 L11.1 R195.1)
VIN: Block Diagram (J29.2), USB Type C (C48.2 C49.2 U4.33 U4.34), Power (R182.1 R183.1), Battery Manager (8 pins)
VSYS: Block Diagram (J29.1), I2S Audio (9 pins), FMC 400 Pin (J24.C35 J24.C37), Power (C143.2 C210.2 U20.1 U23.3), Battery Manager (10 pins), Power Main Regulators (11 pins)
ALERT: Snickerdoodle FPGA JA (J5.37), Battery Manager (U1.14)
AUX_N: Snickerdoodle FPGA JA (J5.12), USB Type C (R226.2 U4.55)
AUX_P: Snickerdoodle FPGA JA (J5.14), USB Type C (R224.1 U4.54)
BTN_BOTTOM: User Interface (C12.2 R17.1), Snickerdoodle PS (J26.2)
BTN_LEFT: User Interface (C10.2 R14.1), Snickerdoodle PS (J26.7)
BTN_LEFT_SEL: User Interface (C5.2 R4.1), Snickerdoodle PS (J26.17)
BTN_LEFT_SHLDR: User Interface (C7.2 R8.1), Snickerdoodle PS (J26.19)
BTN_RIGHT: User Interface (C11.2 R15.1), Snickerdoodle PS (J26.5)
BTN_RIGHT_SEL: User Interface (C6.2 R5.1), Snickerdoodle PS (J26.11)
BTN_RIGHT_SHLDR: User Interface (C8.2 R9.1), Snickerdoodle PS (J26.12)
BTN_TOP: User Interface (C9.2 R11.1), Snickerdoodle PS (J26.13)
CLK0_M2C_N: Snickerdoodle FPGA JB (J6.35), FMC 400 Pin (J24.H5)
CLK0_M2C_P: Snickerdoodle FPGA JB (J6.37), FMC 400 Pin (J24.H4)
CLK1_M2C_N: Snickerdoodle FPGA JB (J10.35), FMC 400 Pin (J24.G3)
CLK1_M2C_P: Snickerdoodle FPGA JB (J10.37), FMC 400 Pin (J24.G2)
CLK2_BIDIR_N: Snickerdoodle FPGA JB (J6.38), FMC 400 Pin (J24.K5)
CLK2_BIDIR_P: Snickerdoodle FPGA JB (J6.36), FMC 400 Pin (J24.K4)
CLK_DIR: Snickerdoodle FPGA JB (J6.4), FMC 400 Pin (J24.B1)
DP1_TX0_N: Snickerdoodle FPGA JA (J5.38), USB Type C (C14.1)
DP1_TX0_P: Snickerdoodle FPGA JA (J5.36), USB Type C (C55.1)
DP1_TX1_N: Snickerdoodle FPGA JA (J5.32), USB Type C (C189.1)
DP1_TX1_P: Snickerdoodle FPGA JA (J5.30), USB Type C (C190.1)
DP1_TX2_N: Snickerdoodle FPGA JA (J5.26), USB Type C (C191.1)
DP1_TX2_P: Snickerdoodle FPGA JA (J5.24), USB Type C (C192.1)
DP1_TX3_N: Snickerdoodle FPGA JA (J5.20), USB Type C (C193.1)
DP1_TX3_P: Snickerdoodle FPGA JA (J5.18), USB Type C (C194.1)
DP_HPD: Snickerdoodle FPGA JA (J4.4), USB Type C (U4.26)
DR_MUTE_N: Snickerdoodle PS (J26.8), I2S Audio (R104.1 U5.22)
FMC_SCL: User Interface (U16.10), Snickerdoodle PS (J27.7 R219.2), I2S Audio (U5.8), FMC 400 Pin (J24.C30)
FMC_SDA: User Interface (U16.9), Snickerdoodle PS (J27.8 R220.2), I2S Audio (U5.7), FMC 400 Pin (J24.C31)
HP_DETECT_N: Snickerdoodle PS (J26.14), I2S Audio (J23.4 R103.2)
I2C_USB_IRQ_N: Snickerdoodle FPGA JA (J5.2), USB Type C (R67.2 U4.43)
I2C_USB_SCL: Snickerdoodle FPGA JA (J5.39 R210.2), USB Type C (J?.3 U4.47)
I2C_USB_SDA: Snickerdoodle FPGA JA (J5.40 R211.2), USB Type C (J?.4 U4.46)
INT_REG_EN: Power (R180.1 S10.1), Power Main Regulators (U21.23)
LA00_CC_N: Snickerdoodle FPGA JB (J10.38), FMC 400 Pin (J24.G7)
LA00_CC_P: Snickerdoodle FPGA JB (J10.36), FMC 400 Pin (J24.G6)
LA01_CC_N: Snickerdoodle FPGA JB (J6.14), FMC 400 Pin (J24.G19)
LA01_CC_P: Snickerdoodle FPGA JB (J6.12), FMC 400 Pin (J24.G18)
LA02_N: Snickerdoodle FPGA JB (J10.29), FMC 400 Pin (J24.H14)
LA02_P: Snickerdoodle FPGA JB (J10.31), FMC 400 Pin (J24.H13)
LA03_N: Snickerdoodle FPGA JB (J10.23), FMC 400 Pin (J24.C15)
LA03_P: Snickerdoodle FPGA JB (J10.25), FMC 400 Pin (J24.C14)
LA04_N: Snickerdoodle FPGA JB (J10.17), FMC 400 Pin (J24.G16)
LA04_P: Snickerdoodle FPGA JB (J10.19), FMC 400 Pin (J24.G15)
LA05_N: Snickerdoodle FPGA JB (J10.11), FMC 400 Pin (J24.G10)
LA05_P: Snickerdoodle FPGA JB (J10.13), FMC 400 Pin (J24.G9)
LA06_N: Snickerdoodle FPGA JB (J10.5), FMC 400 Pin (J24.H11)
LA06_P: Snickerdoodle FPGA JB (J10.7), FMC 400 Pin (J24.H10)
LA07_N: Snickerdoodle FPGA JB (J10.32), FMC 400 Pin (J24.G13)
LA07_P: Snickerdoodle FPGA JB (J10.30), FMC 400 Pin (J24.G12)
LA08_N: Snickerdoodle FPGA JB (J10.26), FMC 400 Pin (J24.D12)
LA08_P: Snickerdoodle FPGA JB (J10.24), FMC 400 Pin (J24.D11)
LA09_N: Snickerdoodle FPGA JB (J10.20), FMC 400 Pin (J24.C11)
LA09_P: Snickerdoodle FPGA JB (J10.18), FMC 400 Pin (J24.C10)
LA10_N: Snickerdoodle FPGA JB (J10.14), FMC 400 Pin (J24.D9)
LA10_P: Snickerdoodle FPGA JB (J10.12), FMC 400 Pin (J24.D8)
LA11_N: Snickerdoodle FPGA JB (J10.8), FMC 400 Pin (J24.H8)
LA11_P: Snickerdoodle FPGA JB (J10.6), FMC 400 Pin (J24.H7)
LA12_N: Snickerdoodle FPGA JB (J6.32), FMC 400 Pin (J24.C19)
LA12_P: Snickerdoodle FPGA JB (J6.30), FMC 400 Pin (J24.C18)
LA13_N: Snickerdoodle FPGA JB (J6.26), FMC 400 Pin (J24.D18)
LA13_P: Snickerdoodle FPGA JB (J6.24), FMC 400 Pin (J24.D17)
LA14_N: Snickerdoodle FPGA JB (J6.20), FMC 400 Pin (J24.H17)
LA14_P: Snickerdoodle FPGA JB (J6.18), FMC 400 Pin (J24.H16)
LA15_N: Snickerdoodle FPGA JB (J6.5), FMC 400 Pin (J24.C23)
LA15_P: Snickerdoodle FPGA JB (J6.7), FMC 400 Pin (J24.C22)
LA16_N: Snickerdoodle FPGA JB (J6.23), FMC 400 Pin (J24.D21)
LA16_P: Snickerdoodle FPGA JB (J6.25), FMC 400 Pin (J24.D20)
LA17_CC_N: Snickerdoodle FPGA JB (J6.8), FMC 400 Pin (J24.D15)
LA17_CC_P: Snickerdoodle FPGA JB (J6.6), FMC 400 Pin (J24.D14)
LA18_CC_N: Snickerdoodle FPGA JB (J6.29), FMC 400 Pin (J24.H20)
LA18_CC_P: Snickerdoodle FPGA JB (J6.31), FMC 400 Pin (J24.H19)
LCD_BL_DIM: Snickerdoodle FPGA JA (J5.35), LCD (R167.1 U18.4)
LCD_PWR_EN: Snickerdoodle PS (J26.18), LCD (R153.1 U17.24)
LRCLK: Snickerdoodle FPGA JA (J5.5), I2S Audio (U5.16)
MCLK: Snickerdoodle FPGA JA (J5.8), I2S Audio (U5.13)
NetT2_1: Block Diagram (T2.1), Power Main Regulators (U21.41)
PG_C2M: Block Diagram (R117.2), FMC 400 Pin (J24.D1)
PG_M2C: Block Diagram (R116.2), FMC 400 Pin (J24.F1)
PRSNT_M2C_L: Block Diagram (R1.2), Snickerdoodle PS (J26.20), FMC 400 Pin (J24.H2)
SCLK: Snickerdoodle FPGA JA (J5.6), I2S Audio (U5.14)
SDIN: Snickerdoodle FPGA JA (J5.4), I2S Audio (U5.15)
SPKR_SHTDWN_N: Snickerdoodle PS (J26.6), I2S Audio (R100.2 U5.6)
TFT_RESET: Snickerdoodle FPGA JA (J5.7), LCD (J16.5 Q11.1 R151.1)
TOUCH_INT_N: Snickerdoodle FPGA JA (J4.2), LCD (J11.5)
TOUCH_SCL: Snickerdoodle FPGA JA (J4.39 R208.2), LCD (J11.3), Battery Manager (J12.3 U1.17), Power Main Regulators (U21.43)
TOUCH_SDA: Snickerdoodle FPGA JA (J4.40 R209.2), LCD (J11.2), Battery Manager (J12.4 U1.16), Power Main Regulators (U21.42)
ULPI_CLK: Snickerdoodle PS (J26.35), USB Phy (U15.12)
ULPI_D0: Snickerdoodle PS (J26.29), USB Phy (U15.16)
ULPI_D1: Snickerdoodle PS (J26.31), USB Phy (U15.15)
ULPI_D2: Snickerdoodle PS (J26.32), USB Phy (U15.14)
ULPI_D3: Snickerdoodle PS (J26.30), USB Phy (U15.13)
ULPI_D4: Snickerdoodle PS (J26.23), USB Phy (U15.11)
ULPI_D5: Snickerdoodle PS (J26.37), USB Phy (U15.10)
ULPI_D6: Snickerdoodle PS (J26.38), USB Phy (U15.9)
ULPI_D7: Snickerdoodle PS (J26.36), USB Phy (U15.8)
ULPI_DIR: Snickerdoodle PS (J26.25), USB Phy (U15.19)
ULPI_NXT: Snickerdoodle PS (J26.24), USB Phy (U15.18)
ULPI_RST_N: Snickerdoodle PS (J26.4), USB Phy (R176.1 U15.22)
ULPI_STP: Snickerdoodle PS (J26.26), USB Phy (U15.20)

## Assembly variants
DEFAULT: not fitted C195 C196 J3 J9 J17 J28 J29 R223 R224 R225 R226